# EAGLE design microXusb401_r15 (EAGLE 7.2.0)
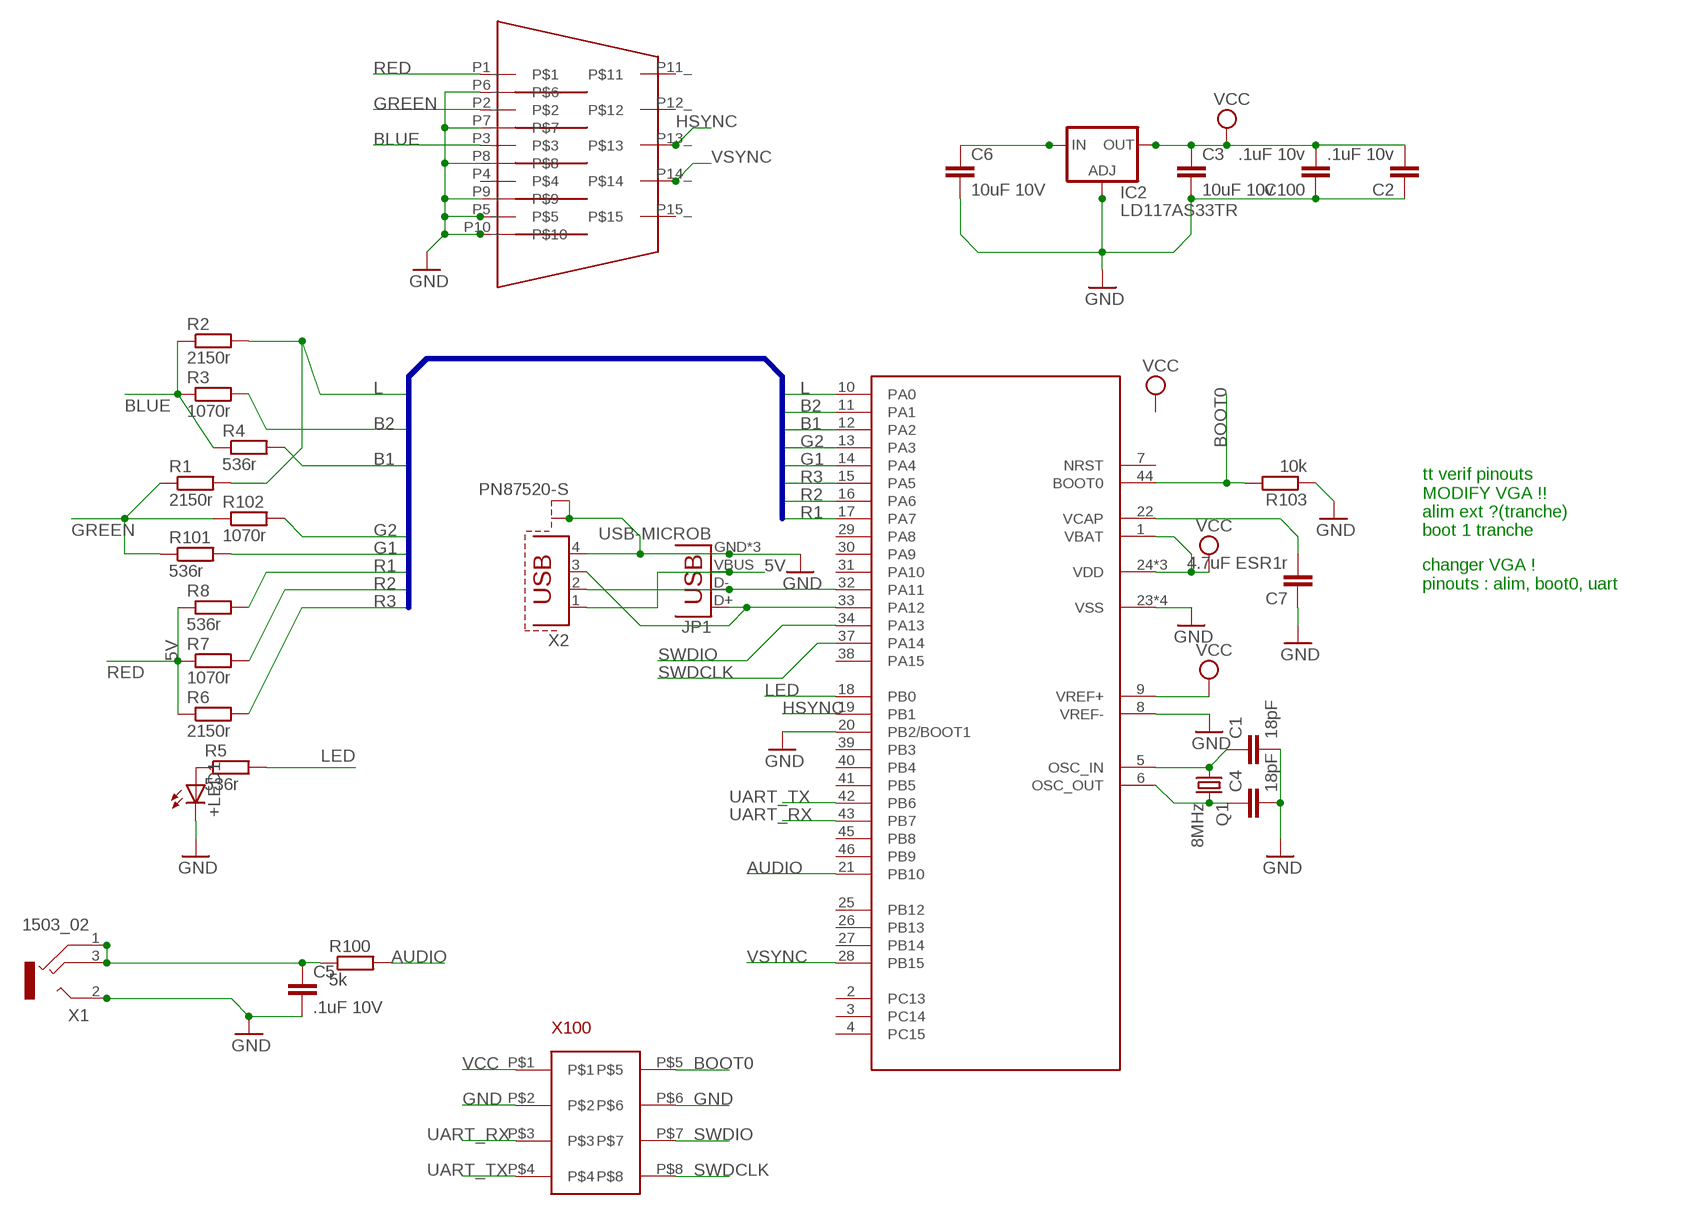
[diagram p0: schematic, sheet 1]

## Parts
+LED1  LEDCHIPLED_0805  [CHIPLED_0805]
C1  18pF  C-EUC1608  [C1608]
C2  .1uF 10v  C-EUC1608  [C1608]
C3  10uF 10v  C-EUC1608  [C1608]
C4  18pF  C-EUC1608  [C1608]
C5  .1uF 10V  C-EUC1608  [C1608]
C6  10uF 10V  C-EUC1608  [C1608]
C7  4.7uF ESR1r  C-EUC1608  [C1608]
C100  .1uF 10v  C-EUC1608  [C1608]
CON1  VGA_GTK_USLIM  [VGA_SLIM3]
IC1  STM32F401CCUQFN48_B  [QFN-48]
IC2  LD117AS33TR  [SOT223]
JP1  USB-MICROB  [USB-MICROB]
Q1  8MHz  CRYSTALSM49  [SM49]
R1  2150r  R-EU_R0603  [R0603]
R2  2150r  R-EU_R0603  [R0603]
R3  1070r  R-EU_R0603  [R0603]
R4  536r  R-EU_R0603  [R0603]
R5  536r  R-EU_R0603  [R0603]
R6  2150r  R-EU_R0603  [R0603]
R7  1070r  R-EU_R0603  [R0603]
R8  536r  R-EU_R0603  [R0603]
R100  5k  R-EU_R0603  [R0603]
R101  536r  R-EU_R0603  [R0603]
R102  1070r  R-EU_R0603  [R0603]
R103  10k  R-EU_R0603  [R0603]
X1  1503_02  [1503_02]
X2  PN87520-S  [PN87520-S]
X100  HEADER_BORDER_4X2  [HEADER_BORDER_4X2]

## Nets
5V: C6.1 IC2.3(IN) JP1.VBUS X2.1
AUDIO: IC1.21(PB10) R100.2
B1: IC1.12(PA2) R4.2
B2: IC1.11(PA1) R3.2
BLUE: CON1.P3_ R2.1 R3.1 R4.1
BOOT0: IC1.44(BOOT0) R103.2 X100.P$5
G1: IC1.14(PA4) R101.2
G2: IC1.13(PA3) R102.2
GND: +LED1.C C1.2 C2.1 C3.2 C4.2 C5.2 C6.2 C7.1 C100.1 CON1.P5_ CON1.P6_ CON1.P7_ CON1.P8_ CON1.P9_ CON1.P10_ IC1.8(VREF-) IC1.20(PB2/BOOT1) IC1.23(VSS) IC1.35(VSS) IC1.47(VSS) IC1.EXP(VSS) IC2.1(ADJ) JP1.GND JP1.MT1(GND) JP1.MT2(GND) R103.1 X1.2 X2.4 X2.S1 X2.S2 X100.P$2 X100.P$6
GREEN: CON1.P2_ R1.1 R101.1 R102.1
HSYNC: CON1.P13_ IC1.19(PB1)
L: IC1.10(PA0) R1.2 R2.2
LED: IC1.18(PB0) R5.2
N$1: IC1.33(PA12) JP1.D+ X2.3
N$2: IC1.32(PA11) JP1.D- X2.2
N$8: C7.2 IC1.22(VCAP)
N$10: C5.1 R100.1 X1.1 X1.3
N$19: +LED1.A R5.1
N$24: C1.1 IC1.5(OSC_IN) Q1.1
N$25: C4.1 IC1.6(OSC_OUT) Q1.2
R1: IC1.17(PA7) R8.2
R2: IC1.16(PA6) R7.2
R3: IC1.15(PA5) R6.2
RED: CON1.P1_ R6.1 R7.1 R8.1
SWDCLK: IC1.37(PA14) X100.P$8
SWDIO: IC1.34(PA13) X100.P$7
UART_RX: IC1.43(PB7) X100.P$3
UART_TX: IC1.42(PB6) X100.P$4
VCC: C2.2 C3.1 C100.2 IC1.1(VBAT) IC1.9(VREF+) IC1.24(VDD) IC1.36(VDD) IC1.48(VDD) IC2.4(OUT) X100.P$1
VSYNC: CON1.P14_ IC1.28(PB15)
Unconnected: CON1.P4_ CON1.P11_ CON1.P12_ CON1.P15_ IC1.2(PC13) IC1.3(PC14) IC1.4(PC15) IC1.7(NRST) IC1.25(PB12) IC1.26(PB13) IC1.27(PB14) IC1.29(PA8) IC1.30(PA9) IC1.31(PA10) IC1.38(PA15) IC1.39(PB3) IC1.40(PB4) IC1.41(PB5) IC1.45(PB8) IC1.46(PB9) X1.2@2

## Buses
R1,R2,R3,G1,G2,B1,B2,L

## Notes on the sheet
- tt verif pinouts 
  MODIFY VGA !!
  alim ext ?(tranche)
  boot 1 tranche
- changer VGA !
  pinouts : alim, boot0, uart

## Library data of the parts
+LED1 = adafruit:LED: LED OSRAM: - CHIPLED LG R971, LG N971, LY N971, LG Q971, LY Q971, LO R971, LY R971 LH N974, LH R974 LS Q976, LO Q976, LY Q976 LO Q996 - Hyper CHIPLED LW Q18S LB Q993, LB Q99A, LB R99A - SideLED LS A670, LO A670, LY A670, LG A670, LP A670 LB A673, LV A673, LT A673, LW A673 LH A674 LY A675 LS A676, LA A676, LO A676, LY A676, LW A676 LS A679, LY A679, LG A679 - Hyper Micro SIDELED® LS Y876, LA Y876, LO Y876, LY Y876 LT Y87S - SmartLED LW L88C, LW L88S LB L89C, LB L89S, LG L890 LS L89K, LO L89K, LY L89K LS L896, LA L896, LO L896, LY L896 - TOPLED LS T670, LO T670, LY T670, LG T670, LP T670 LSG T670, LSP T670, LSY T670, LOP T670, LYG T670 LG T671, LOG T671, LSG T671 LB T673, LV T673, LT T673, LW T673 LH T674 LS T676, LA T676, LO T676, LY T676, LB T676, LH T676, LSB T676, LW T676 LB T67C, LV T67C, LT T67C, LS T67K, LO T67K, LY T67K, LW E67C LS E67B, LA E67B, LO E67B, LY E67B, LB E67C, LV E67C, LT E67C LW T67C LS T679, LY T679, LG T679 LS T770, LO T770, LY T770, LG T770, LP T770 LB T773, LV T773, LT T773, LW T773 LH T774 LS E675, LA E675, LY E675, LS T675 LS T776, LA T776, LO T776, LY T776, LB T776 LHGB T686 LT T68C, LB T68C - Hyper Mini TOPLED® LB M676 - Mini TOPLED Santana® LG M470 LS M47K, LO M47K, LY M47K Source: http://www.osram.convergy.de/
C1-C7 C100 = resistor:C-EU: CAPACITOR, European symbol
CON1 = microX:VGA_GTK_USLIM
IC1 = microX:STM32F401CCU
IC2 = v-reg:LD117A?*: Low drop fixed and adjustable positive voltage regulators 1 A Source: http://www.st.com/stonline/products/literature/ds/7194/ld1117axx.pdf
JP1 = SparkFun-Connectors:USB: USB Connectors USB-B-PTH is fully proven SKU : PRT-00139/CONN-08278 USB-miniB is fully proven SKU : PRT-00587 USB-A-PCB is untested. USB-A-H is throughly reviewed, but untested. Spark Fun Electronics SKU : PRT-00437 USB-B-SMT is throughly reviewed, but untested. Needs silkscreen touching up. USB-A-S has not been used/tested USB-MB-H has not been used/tested USB-MICROB has been used. CONN-09505; PROD_ID: CONN-09505
Q1 = crystal:CRYSTAL: CRYSTAL; OC_FARNELL: unknown; OC_NEWARK: unknown
R1-R8 R100-R103 = resistor:R-EU_: RESISTOR, European symbol
X1 = con-lumberg:1503_02: Jack connectors according to JISC 6560, 3.5 mm Klinkeneinbaukupplung nach JISC 6560, 3,5 mm, 3-polig/stereo, abgewinkelte Ausführung, Surface-Mount-Technik (SMT) Source: http://www.lumberg.com/Produkte/PDFs/1503_02.pdf; OC_FARNELL: 1216979; OC_NEWARK: unknown
X2 = con-berg:PN87520-S; OC_FARNELL: unknown; OC_NEWARK: unknown
X100 = microX:HEADER_BORDER_4X2

## Board
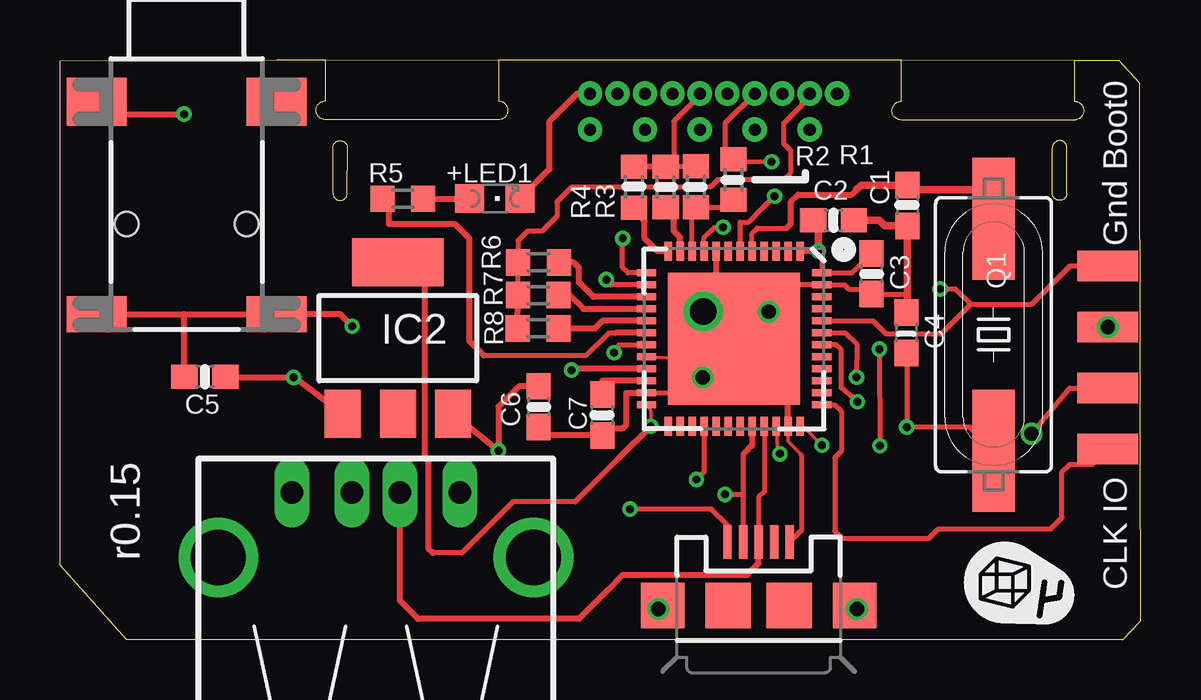
[diagram p1: board, top side]
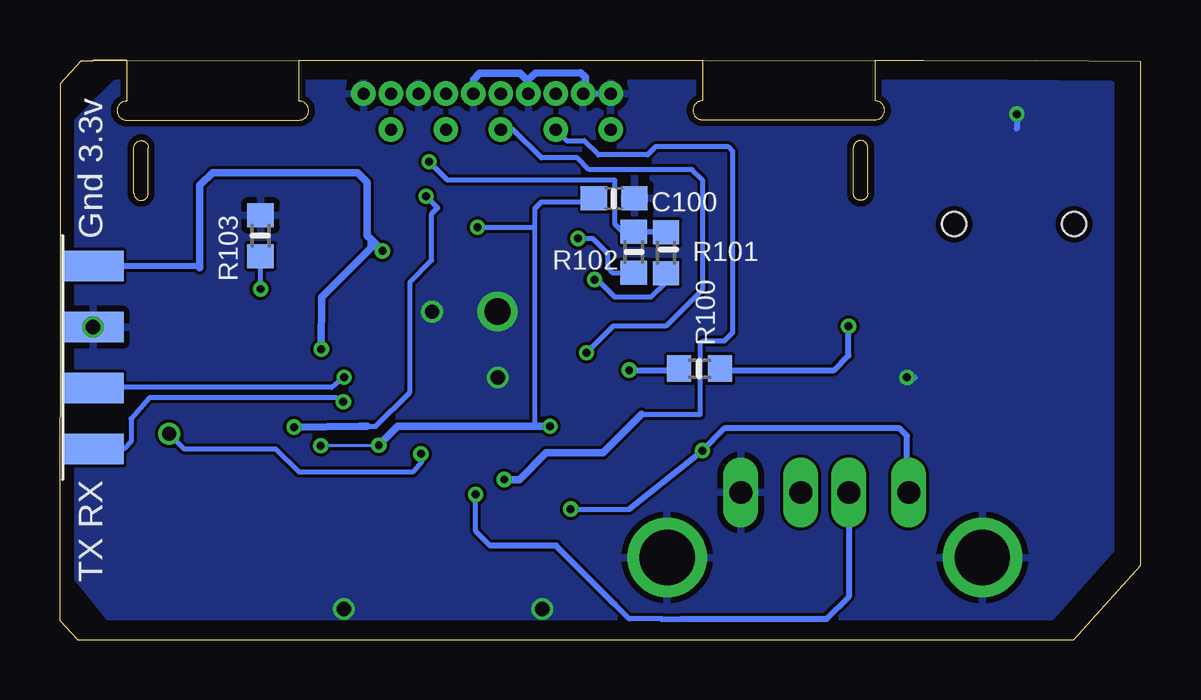
[diagram p2: board, bottom side, seen from below]

Size 45.05 x 24.15 mm. Coordinates in mm from the lower left corner, seen from the top.
Outline: 44.31,0 45.05,0.78 45.04,8.38 45.02,10.16 45.02,23.19 44.16,24.12 43.66,24.12 4.31,24.13 0,24.09 0,3.09 2.78,0 44.31,0
Copper layers (1*16): Top 0.035mm / dielectric 1.5mm / Bottom 0.035mm
Design rules "dirt_cheap_dirty_boards.v1": minimum track width 5mil, minimum drill 12mil, track to track 5mil, track to pad 5mil, pad to pad 5mil, via to via 5mil, smd to smd 0mil, copper to edge 10mil, drill to drill 10mil, minimum pad ring 10mil, minimum via ring 6mil, stop-mask expansion 2mil, vias tented up to drill 25mil, thermal gap 10mil

### Footprints (pad centres in the part's own frame; a part is rotated, then mirrored left to right if it is on the bottom)
CHIPLED_0805 = smd 1.2 x 1.2: A 0,-1.05; C 0,1.05
C1608 = smd 1.1 x 1: 1 -0.85,0; 2 0.85,0
VGA_SLIM3 = drill 0.508 pad 0.813: P1_ -4.58,0; P2_ -2.29,0; P3_ 0,0; P4_ 2.29,0; P5_ 4.58,0; P6_ -5.725,0; P7_ -3.435,0; P8_ -1.145,0; P9_ 1.145,0; P10_ 3.435,0; P11_ -4.58,1.5; P12_ -2.29,1.5; P13_ 0,1.5; P14_ 2.29,1.5; P15_ 4.58,1.5
QFN-48 = smd 0.8 x 0.3: 1 -3.4,2.5; 2 -3.4,2; 3 -3.4,1.5; 4 -3.4,1; 5 -3.4,0.5; 6 -3.4,0; 7 -3.4,-0.5; 8 -3.4,-1; 9 -3.4,-1.5; 10 -3.4,-2; 11 -3.4,-2.5; 12 -3.4,-3; 25 3.9,-3; 26 3.9,-2.5; 27 3.9,-2; 28 3.9,-1.5; 29 3.9,-1; 30 3.9,-0.5; 31 3.9,0; 32 3.9,0.5; 33 3.9,1; 34 3.9,1.5; 35 3.9,2; 36 3.9,2.5 | smd 0.3 x 0.8: 13 -2.5,-3.9; 14 -2,-3.9; 15 -1.5,-3.9; 16 -1,-3.9; 17 -0.5,-3.9; 18 0,-3.9; 19 0.5,-3.9; 20 1,-3.9; 21 1.5,-3.9; 22 2,-3.9; 23 2.5,-3.9; 24 3,-3.9; 37 3,3.4; 38 2.5,3.4; 39 2,3.4; 40 1.5,3.4; 41 1,3.4; 42 0.5,3.4; 43 0,3.4; 44 -0.5,3.4; 45 -1,3.4; 46 -1.5,3.4; 47 -2,3.4; 48 -2.5,3.4 | smd 5.5 x 5.5: EXP 0.258,-0.251
SOT223 = smd 1.5 x 2: 1 -2.3,-3.15; 2 0,-3.15; 3 2.3,-3.15 | smd 3.8 x 2: 4 0,3.15
USB-MICROB = smd 0.35 x 1.4: D+ 0,2.65; D- -0.65,2.65; GND 1.3,2.65; ID 0.65,2.65; VBUS -1.3,2.65 | smd 1.8 x 1.9: MT1 -4,0; MT2 4,0 | smd 1.9 x 1.9: P$1 -1.27,0; P$2 1.27,0
SM49 = smd 5.08 x 1.778: 1 -4.826,0; 2 4.826,0
R0603 = smd 1 x 1.1: 1 -0.85,0; 2 0.85,0
1503_02 = smd 2.5 x 1.5: 1 -3.75,-10.75; 3 3.75,-10.75 | smd 2.5 x 2: 2 -3.75,-1.9; 2@2 3.75,-1.9 | hole 1: -2.5,-7; 2.5,-7
PN87520-S = drill 0.95 long: 1 -3.5,2.71; 2 -1,2.71; 3 1,2.71; 4 3.5,2.71 | drill 2.3 pad 2.9: S1 -6.57,0; S2 6.57,0
HEADER_BORDER_4X2 = smd 2.54 x 1.27: P$1 -1.27,5.08; P$2 -1.27,2.54; P$3 -1.27,0; P$4 -1.27,-2.54 | smd 2.54 x 1.27 bottom: P$5 -1.27,5.08; P$6 -1.27,2.54; P$7 -1.27,0; P$8 -1.27,-2.54

### Placement (x,y rotation side)
+LED1  18.13,18.37 270 top
C1  35.32,18.09 270 top
C2  32.25,17.46 180 top
C3  33.83,15.24 270 top
C4  35.29,12.78 90 top
C5  6.05,10.95 0 top
C6  19.95,9.7 270 top
C7  22.61,9.35 90 top
C100  21.95,18.39 180 bottom
CON1  26.67,22.74 180 top
IC1  28.35,12.78 270 top
IC2  14.08,12.56 0 top
JP1  29.12,1.42 0 top
Q1  38.91,12.7 270 top
R1  28.07,19.16 270 top
R2  26.51,18.86 270 top
R3  25.24,18.86 270 top
R4  23.93,18.85 270 top
R5  14.29,18.37 180 top
R6  19.94,15.72 0 top
R7  19.94,14.35 0 top
R8  19.93,12.97 0 top
R100  18.39,11.29 180 bottom
R101  19.79,16.12 270 bottom
R102  21.13,16.14 270 bottom
R103  36.69,16.83 270 bottom
X1  5.28,24.31 0 top
X2  13.17,3.42 0 top
X100  42.41,10.48 0 bottom

### Tracks (layer width: path | path; a pad name or v marks a point on that pad's centre or on a via)
5V  (via drill 0.33)
  Top 0.203: JP1.VBUS 27.82,4.77 27.16,5.44 v23.76,5.44
  Top 0.254: C6.1 19.13,10.55 18.28,9.7 v18.28,7.87 IC2.3
  Bottom 0.203: v23.76,5.44 21.32,5.44
  Bottom 0.254: 21.32,5.44 v18.28,7.87 17.35,8.8 10.06,8.8 9.74,8.48 9.74,6.2 X2.1
AUDIO  (via drill 0.33)
  Top 0.254: IC1.21 21.38,11.28 arc90 v21.32,11.23
  Bottom 0.254: v21.32,11.23 19.3,11.23 arc-90 R100.2
B1
  Top 0.254: IC1.12 24.9,16.18 24.37,16.71 24.37,17.41 R4.2
B2
  Top 0.254: IC1.11 25.85,16.76 25.59,17.02 25.59,17.49 R3.2
BLUE
  Top 0.203: R2.1 R3.1 25.59,20.06 25.59,21.59 26.67,22.67 CON1.P3_
  Top 0.254: R3.1 R4.1 | R4.1 23.94,19.54 23.93,19.54 23.94,19.54 R4.1
BOOT0  (via drill 0.33)
  Top 0.203: X100.P$5 42.09,15.56 40.5,13.97 37.96,13.97 | IC1.44 33.89,13.28 34.43,12.74 36.73,12.74 37.96,13.97 | 37.96,13.97 37.33,14.61 v36.69,14.61
  Bottom 0.203: v36.69,14.61 R103.2
G1  (via drill 0.33)
  Top 0.203: IC1.14 22.95,14.78 v22.77,15
  Bottom 0.203: v22.77,15 22.54,14.88 21.93,14.28 20.41,14.28 19.79,14.89 R101.2
G2  (via drill 0.33)
  Top 0.203: IC1.13 23.67,15.28 23.46,15.49 v23.46,16.71
  Bottom 0.203: v23.46,16.71 22.85,16.71 22.24,16.1 22.24,15.49 22.04,15.29 R102.2 | 21.34,15.49 R102.2 | 21.43,15.29 R102.2
GND  (via drill 0.33, 0.6, 1.1)
  Top 0.152: IC1.20 27.37,11.63 27.04,11.3 25.87,10.13 | IC1.35 30.37,8.54 30.34,8.52 30.34,8.26 30.9,7.69 | 35.32,13.21 C4.2 35.42,13.34 35.42,13.65 | IC1.47 31.39,14.78 31.38,14.79 | 30.25,14.79 30.25,14.37 v29.54,13.66
  Top 0.203: IC1.23 25.72,10.28 arc-90 25.87,10.13 | IC1.47 32.7,14.78 32.88,14.61 33.62,14.61 C3.2 35.22,14.39 35.32,14.29 | 31.78,14.79 31.38,14.79 30.25,14.79 | 30.9,7.69 30.9,4.55 JP1.GND | JP1.MT1 24.97,1.27 v24.94,1.27 | v33.22,1.27 33.12,1.37 JP1.MT2
  Top 0.254: IC1.35 30.35,10.31 30.47,10.31 30.47,12.52 IC1.EXP 28.1,11.84 | 28.1,11.84 28.1,11.63 27.37,11.63 | IC1.8 27.35,11.84 28.1,11.84 | IC2.1 9.75,10.93 v9.74,10.92 6.92,10.92 C5.2 | X1.2 2.05,21.89 v5.17,21.89 | IC1.23 23.6,10.28 23.6,8.93 23.46,8.79 22.89,8.79 C7.1 20.3,8.5 C6.2 | 24.68,1.54 v24.94,1.27 | v26.8,10.92 26.8,11.3 27.04,11.3 | +LED1.C 20.41,19.61 20.41,21.59 21.56,22.74 CON1.P5_
  Top 0.305: 35.32,13.21 35.32,14.29 C1.2 34.38,17.24 34.15,17.46 C2.1
  Bottom 0.203: CON1.P10_ 23.15,22.83 | 25.49,23.36 25.65,23.36
  Bottom 0.254: CON1.P10_ 22.09,22.75 | v9.74,10.92 9.44,10.92 | v5.17,21.89 5.17,21.29
  Bottom 0.305: CON1.P8_ 27.82,23.32 27.55,23.59 25.88,23.59 25.65,23.36 25.53,23.24 CON1.P9_ | 23.15,22.83 23.15,23.42 23.35,23.61 25.23,23.6 25.49,23.36
  other vias: 43.68,13.02 26.81,13.67
  pour Bottom: 42.72,23.18 5.58,23.18 1.26,23.13 1.26,3.73 3.73,0.95 43.04,0.95 44.31,2.54 44.31,21.59
GREEN  (via drill 0.33)
  Top 0.203: CON1.P2_ 27.72,21.5 27.72,20.36 R1.1 28.16,19.93 v29.66,19.91
  Bottom 0.203: R102.1 21.6,16.99 21.93,17.32 21.93,19.15 28.91,19.15 v29.66,19.91
  Bottom 0.254: R101.1 21.34,16.99 R102.1
HSYNC  (via drill 0.33)
  Top 0.203: v23.1,11.95 23.29,12.28 IC1.19
  Bottom 0.203: 26.67,21.15 CON1.P13_ 26.16,21.24 24.98,20.07 23.49,20.07 23,19.58 18.7,19.58 18.28,19.15 18.28,14.58 19.8,13.06 22,13.06 v23.1,11.95
L
  Top 0.203: IC1.10 26.35,17.85 arc-90 R2.2 27.77,18.01 arc90 R1.2
LED
  Top 0.203: 17.67,11.84 21.93,11.84 22.88,12.78 23.15,12.78
  Top 0.254: IC1.18 23.15,12.78 | R5.2 13.7,18.1 13.7,17.32 16.45,17.32 17.06,16.71 17.06,12.45 17.67,11.84
N$1
  Top 0.152: IC1.33 29.37,8.59
  Top 0.203: 29.37,8.59 29.37,6.16 29.12,5.92 JP1.D+
  Top 0.254: X2.3 14.17,1.62 14.92,0.86 21.63,0.86 22.85,2.08 23.46,2.69 28.64,2.69 29.12,3.18 JP1.D+
N$2  (via drill 0.33)
  Top 0.203: 28.5,7.74 28.47,7.71 28.47,6.04 | 28.47,6.04 JP1.D- | v27.72,6.04 28.47,6.04
  Top 0.254: IC1.32 28.85,8.09 28.5,7.74
  Bottom 0.203: 19.97,0.85 19.98,0.86 21.32,0.86 21.93,1.47 | 27.11,3.91 27.72,4.52 v27.72,6.04
  Bottom 0.254: X2.2 12.17,1.79 13.09,0.86 19.16,0.86 19.97,0.85 | 21.93,1.47 24.37,3.91 27.11,3.91
N$8
  Top 0.254: 24.48,10.78 IC1.22 22.61,10.78 C7.2
N$10  (via drill 0.33)
  Top 0.254: X1.1 5.17,13.56 | 5.17,13.56 X1.3 11.68,13.56 v12.18,13.06 | C5.1 5.17,10.97 5.17,13.56
  Bottom 0.254: R100.1 17.48,11.23 12.79,11.23 12.18,11.84 v12.18,13.06
N$19
  Top 0.254: R5.1 15.15,18.37 +LED1.A
N$24
  Top 0.152: Q1.1 38.77,17.67
  Top 0.203: 33.19,18.73 33.2,18.73 | IC1.5 28.85,16.93 29.07,17.14 30.29,17.14
  Top 0.254: 30.29,17.14 30.47,17.32 30.47,18.24 30.77,18.54 33.01,18.54 33.19,18.73
  Top 0.305: 33.2,18.73 33.4,18.94 C1.1 35.53,18.73 38.91,18.73 Q1.1
N$25  (via drill 0.33)
  Top 0.152: 35.32,11.47 C4.1 | 28.36,16.21 IC1.6
  Top 0.203: 28.36,16.21 28.36,17.39 28.71,17.39 29.31,17.98 29.31,17.99 v29.79,18.47 | C4.1 v35.29,8.85 37.94,8.85 Q1.2
  Bottom 0.203: 32.25,8.89 31.89,8.89 30.47,10.31 30.47,14.88 29.55,15.8 29.55,17.74 29.31,17.98 v29.79,18.47
  Bottom 0.305: v35.29,8.85 32.55,8.89 32.25,8.89
R1
  Top 0.254: IC1.17 22.62,13.28 22.3,12.97 R8.2
R2
  Top 0.254: R7.2 21.25,14.35 21.82,13.78 IC1.16
R3
  Top 0.254: IC1.15 22.24,14.28 21.63,14.88 21.63,15.49 21.41,15.72 R6.2
RED
  Top 0.203: R7.1 R6.1 19.09,16.62 19.49,17.02 20.1,17.02 20.71,17.63 20.71,18.24 21.32,18.85 27.11,18.85 27.42,19.15 30.16,19.15 30.47,19.46 30.47,20.37 30.16,20.68 30.16,21.49 30.95,22.28 30.95,22.44 CON1.P1_
  Top 0.254: R8.1 R7.1
SWDCLK
  Top 0.203: IC1.37 32.31,9.78 32.56,9.53 32.56,7.84 32.3,7.57 32.3,4.52 32.6,4.22 36.23,4.22 36.62,4.61 41.3,4.61 41.77,5.08 41.77,6.99 42.09,7.3 43.04,7.3 X100.P$8
SWDIO  (via drill 0.33 pad 0.33, 0.6)
  Top 0.152: v30.01,7.73 29.93,7.81 IC1.34
  Top 0.203: v40.5,8.57 42.09,10.48 X100.P$7
  Bottom 0.203: v40.5,8.57 39.87,7.94 36.06,7.94 35.1,6.99 30.34,6.99 29.96,7.43 v30.01,7.73
UART_RX  (via drill 0.33)
  Top 0.203: IC1.43 32.73,12.78 33.21,12.32 v33.21,10.93
  Bottom 0.203: v33.21,10.93 33.72,10.51 43.3,10.5 43.36,10.48 X100.P$3
UART_TX  (via drill 0.33)
  Top 0.203: v33.24,9.91 32.56,10.49 32.56,12.07 32.35,12.28 IC1.42
  Bottom 0.203: v33.24,9.91 33.56,10.08 41.33,10.07 42.09,9.21 42.09,8.26 42.41,7.94 X100.P$4
VCC  (via drill 0.33, 0.33 pad 0.33)
  Top 0.152: v31.76,8.09 30.87,9 IC1.36 | v24.63,8.89 24.63,9.53 IC1.24
  Top 0.203: IC1.9 26.85,16.76 27.27,17.18 v27.64,17.18 | IC1.1 31.6,16.18 | 31.6,16.18 v31.61,16.19 | 31.6,16.18 31.75,16.03 IC1.48 33.02,15.28 C3.1 | v34.16,12.1 v34.18,8.08 | 23.3,7.57 21.48,5.74 18.89,5.74 16.75,3.61 15.53,3.61
  Top 0.254: 15.53,3.61 15.35,3.79 15.35,7.46 15.23,7.58 15.23,15.34 14.46,15.34 | 23.3,7.57 v24.63,8.89 | 14.92,14.88 14.71,15.1 14.46,15.34 | 14.46,15.34 IC2.4
  Top 0.305: C2.2 31.61,17.25 v31.61,16.19
  Bottom 0.152: v34.18,8.08 v31.76,8.09
  Bottom 0.203: 25.26,17.18 25.26,17.96 24.98,18.24 22.96,18.24 C100.2 | 25.26,17.18 25.26,8.89 | 39.29,15.56 arc90 39.23,15.49 | v27.64,17.18 25.26,17.18
  Bottom 0.254: 39.29,15.56 X100.P$1
  Bottom 0.305: v24.63,8.89 25.26,8.89 30.98,8.89 v31.76,8.09 | 32.09,16.67 32.25,16.83 32.25,19.05 32.65,19.46 38.7,19.46 39.23,18.92 39.23,15.49 | 32.09,16.67 v31.61,16.19 | v34.16,12.1 34.15,14.26 32.09,16.33 32.09,16.67
VSYNC  (via drill 0.33 pad 0.33)
  Top 0.203: IC1.28 26.85,6.99 v26.53,6.67
  Bottom 0.203: CON1.P14_ 23.93,20.79 23.2,20.79 22.61,20.19 20.55,20.19 20.2,20.55 17.22,20.55 17.01,20.33 17.01,12.8 17.36,12.45 18.25,12.45 18.36,12.33 18.36,9.38 20.81,9.38
  Bottom 0.305: 26.21,6.67 v26.53,6.67 25.9,6.67 24.79,7.77 22.42,7.77 20.81,9.38

### Text on the board
tPlace: Gnd Boot0 | CLK IO
bPlace: Gnd 3.3v | TX RX
tNames: r0.15
Document: Audio | VGA